# EAGLE schematic schematic_slave_5_air_pressure (EAGLE 9.6.2)
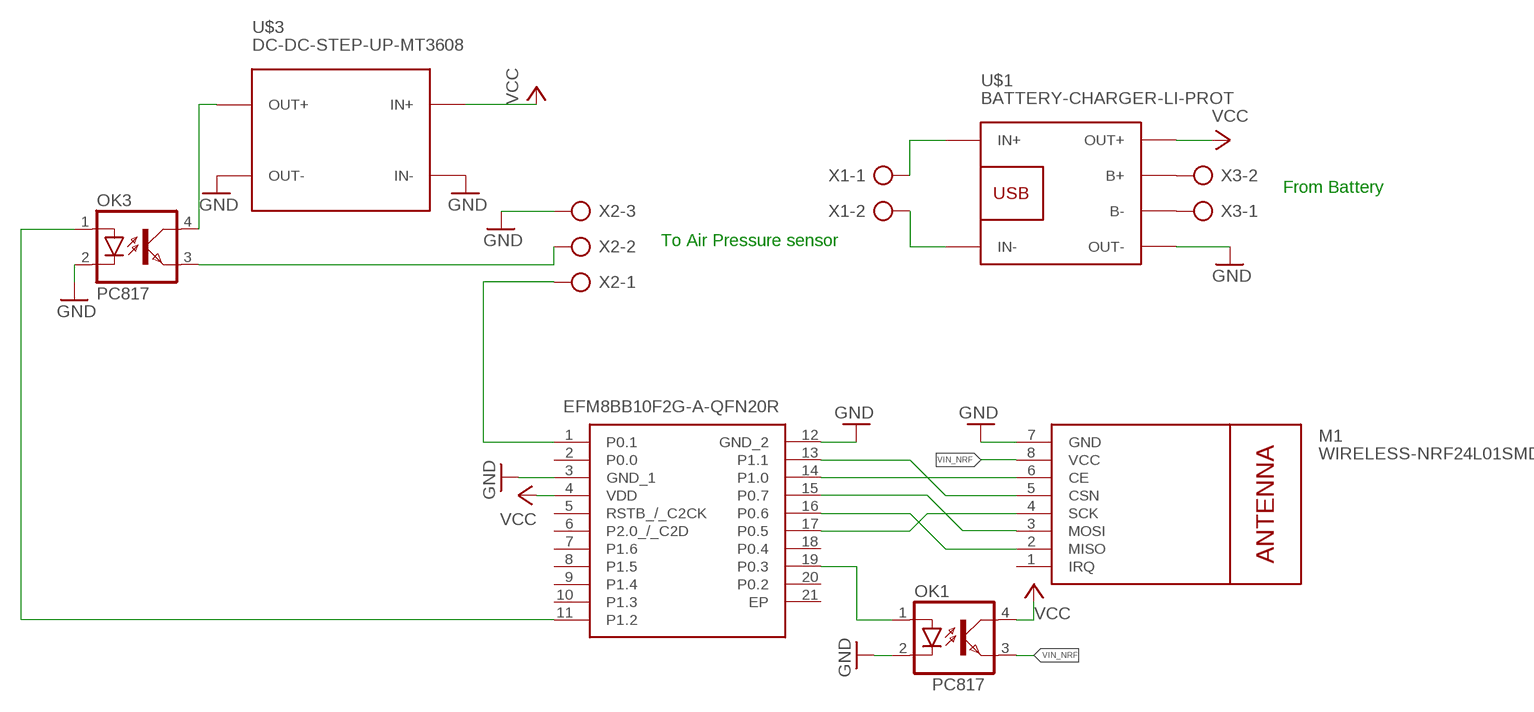
[diagram p0: schematic, sheet 1]

## Parts
IC1  EFM8BB10F2G-A-QFN20R  [EFM8BB10F2GAQFN20R]
M1  WIRELESS-NRF24L01SMD  [WIRELESS-NRF24L01-SMD]
OK1  PC817  [DIL04]
OK3  PC817  [DIL04]
U$1  BATTERY-CHARGER-LI-PROT  [BATTERY-CHARGER-LI-PROT]
U$3  DC-DC-STEP-UP-MT3608  [DC-DC-STEP-UP-MT3608]
X1  AK500/2-H  [AK500/2-H]
X2  AK500/3-H  [AK500/3-H]
X3  AK500/2-H  [AK500/2-H]

## Nets
GND: IC1.3(GND_1) IC1.12(GND_2) M1.7(GND) OK1.2(C) OK3.2(C) U$1.OUT- U$3.IN- U$3.OUT- X2.3
IN+: U$1.IN+ X1.1
IN-: U$1.IN- X1.2
N$1: IC1.11(P1.2) OK3.1(A)
N$2: IC1.1(P0.1) X2.1
N$3: IC1.17(P0.5) M1.4(SCK)
N$4: IC1.16(P0.6) M1.2(MISO)
N$5: IC1.15(P0.7) M1.3(MOSI)
N$6: IC1.14(P1.0) M1.6(CE)
N$7: IC1.13(P1.1) M1.5(CSN)
N$8: IC1.19(P0.3) OK1.1(A)
N$9: OK3.3(EMIT) X2.2
N$10: U$1.B- X3.1
N$11: U$1.B+ X3.2
N$12: OK3.4(COL) U$3.OUT+
VCC: IC1.4(VDD) OK1.4(COL) U$1.OUT+ U$3.IN+
VIN_NRF: M1.8(VCC) OK1.3(EMIT)
Unconnected: IC1.2(P0.0) IC1.5(RSTB_/_C2CK) IC1.6(P2.0_/_C2D) IC1.7(P1.6) IC1.8(P1.5) IC1.9(P1.4) IC1.10(P1.3) IC1.18(P0.4) IC1.20(P0.2) IC1.21(EP) M1.1(IRQ)

## Notes on the sheet
- From Battery
- To Air Pressure sensor

## Library data of the parts
IC1 = SamacSys_Parts:EFM8BB10F2G-A-QFN20R: 8-bit Microcontrollers - MCU 8051 25 MHz 2 kB fla sh 0.25 kB RAM 8-bi Source: Datasheet <https://www.silabs.com/documents/public/data-sheets/efm8bb1-datasheet.pdf>; DESCRIPTION: 8-bit Microcontrollers - MCU 8051 25 MHz 2 kB fla sh 0.25 kB RAM 8-bi; HEIGHT: 0.8mm; MANUFACTURER_NAME: Silicon Labs; MANUFACTURER_PART_NUMBER: EFM8BB10F2G-A-QFN20R; MOUSER_PART_NUMBER: 634-8BB10F2GAQF20R; MOUSER_PRICE-STOCK: https://www.mouser.co.uk/ProductDetail/Silicon-Labs/EFM8BB10F2G-A-QFN20R?qs=DCjbIwhU0ZtADu%252B55HsWtA%3D%3D
M1 = nrf24l01plus:WIRELESS-NRF24L01: 2.4 GHz Wireless Module based on NRF24L01 chip
OK1 OK3 = optocoupler:PC817: SHARP OPTO COUPLER; MPN: PC817X4J000F; OC_FARNELL: 9707727; OC_NEWARK: 97K7059
U$1 = diy-modules_1:BATTERY-CHARGER-LI-PROT: Lithium Battery 5V Charger with protection circuit More details available here: http://www.instructables.com/id/DIY-Lithium-ion-Battery-Charger/step4/TP4056-based-lithium-ion-battery-charger-module/ Click here to find device on ebay.com <http://www.ebay.com/sch/tp4056+charger+usb+protection>
U$3 = diy-modules_1:DC-DC-STEP-UP-MT3608: DC/DC Step-Up Regulator based on MT3608 chip MT3608 datasheet available here: https://www.olimex.com/Products/Breadboarding/BB-PWR-3608/resources/MT3608.pdf Click here to find device on ebay.com <http://www.ebay.com/sch/mt3608+module>
X1 X3 = con-ptr500:AK500/2-H: CONNECTOR Aug. 2004 / PTR Meßtechnik: Die Bezeichnung der Serie AK505 wurde geändert. Es handelt sich hierbei um AK500 in horizontaler Ausführung.; OC_FARNELL: unknown; OC_NEWARK: unknown
X2 = con-ptr500:AK500/3-H: CONNECTOR Aug. 2004 / PTR Meßtechnik: Die Bezeichnung der Serie AK505 wurde geändert. Es handelt sich hierbei um AK500 in horizontaler Ausführung.; OC_FARNELL: unknown; OC_NEWARK: unknown

## Net classes
0 default: width 0.305 mm